# EAGLE design SOC_level_indicator (EAGLE 7.3.0)
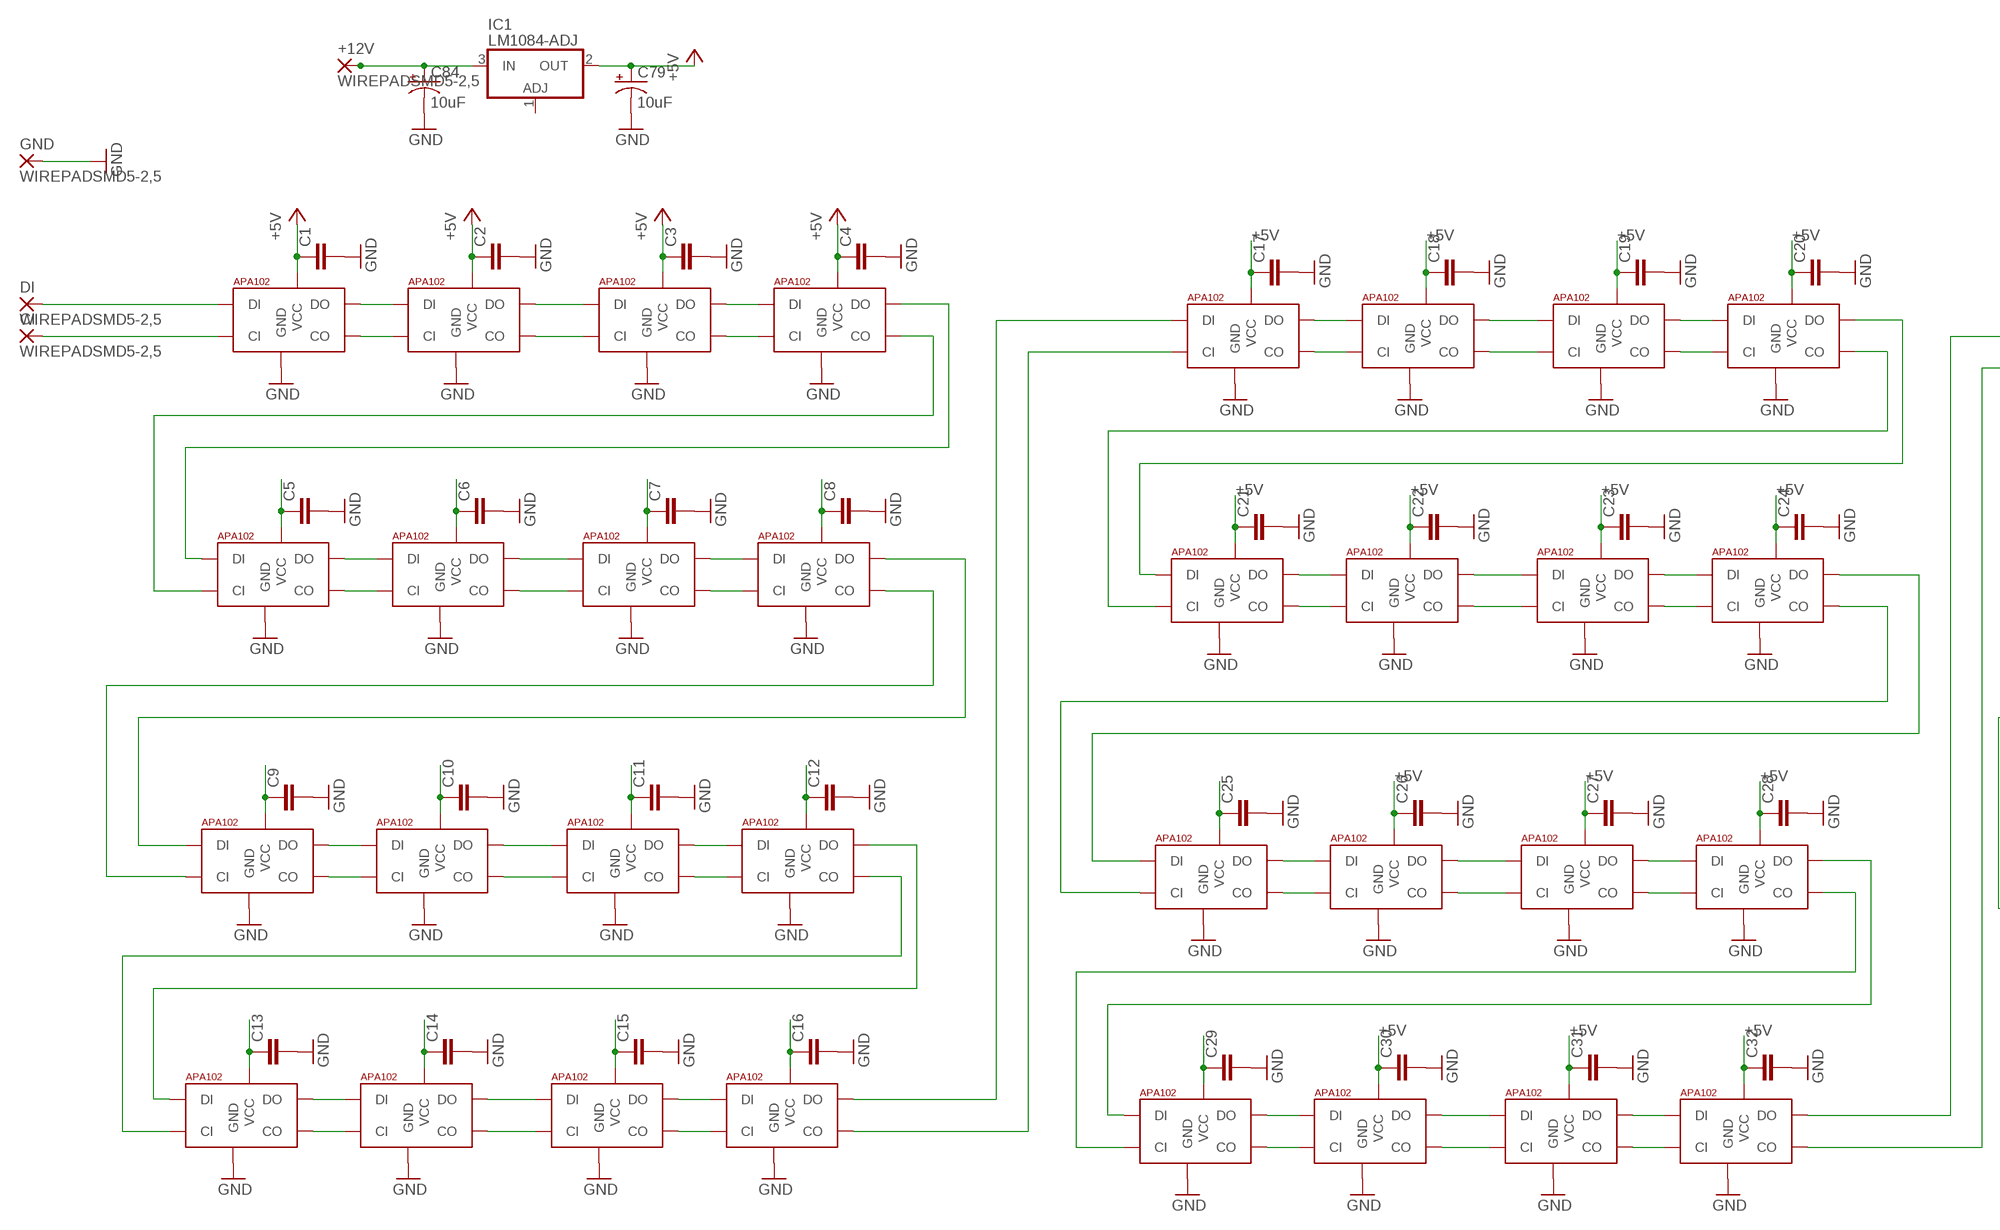
[diagram p0: schematic, sheet 1, part 1 of 2]
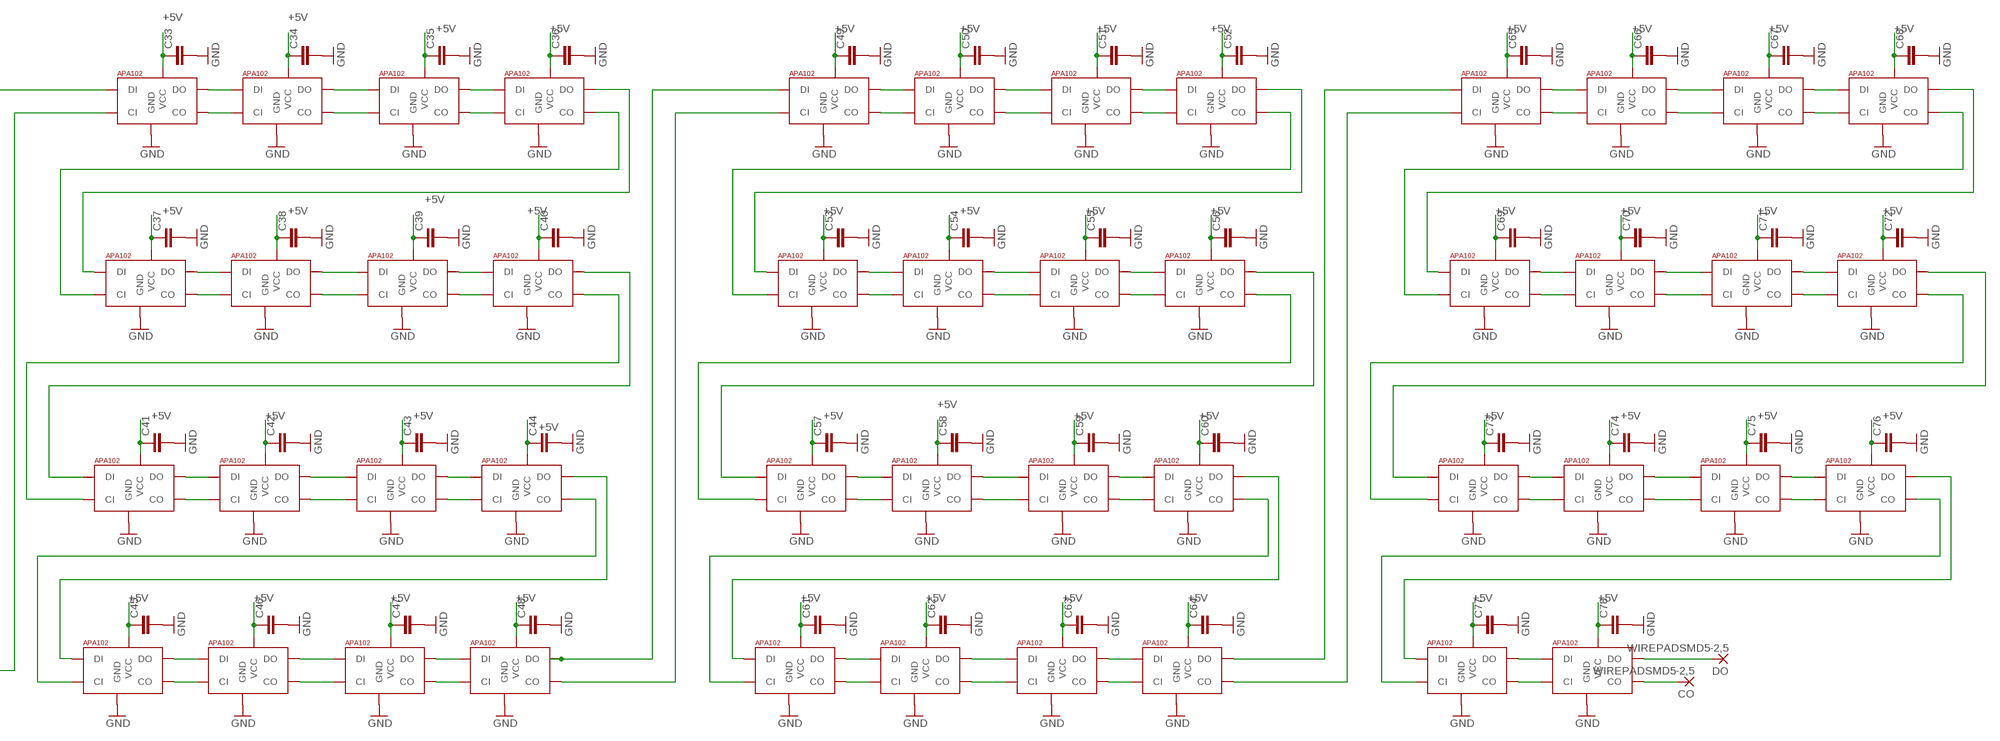
[diagram p1: schematic, sheet 1, part 2 of 2]

## Parts
+12V  WIREPADSMD5-2,5  [5-2,5]
C1  CAP0603-CAP  [0603-CAP]
C2  CAP0603-CAP  [0603-CAP]
C3  CAP0603-CAP  [0603-CAP]
C4  CAP0603-CAP  [0603-CAP]
C5  CAP0603-CAP  [0603-CAP]
C6  CAP0603-CAP  [0603-CAP]
C7  CAP0603-CAP  [0603-CAP]
C8  CAP0603-CAP  [0603-CAP]
C9  CAP0603-CAP  [0603-CAP]
C10  CAP0603-CAP  [0603-CAP]
C11  CAP0603-CAP  [0603-CAP]
C12  CAP0603-CAP  [0603-CAP]
C13  CAP0603-CAP  [0603-CAP]
C14  CAP0603-CAP  [0603-CAP]
C15  CAP0603-CAP  [0603-CAP]
C16  CAP0603-CAP  [0603-CAP]
C17  CAP0603-CAP  [0603-CAP]
C18  CAP0603-CAP  [0603-CAP]
C19  CAP0603-CAP  [0603-CAP]
C20  CAP0603-CAP  [0603-CAP]
C21  CAP0603-CAP  [0603-CAP]
C22  CAP0603-CAP  [0603-CAP]
C23  CAP0603-CAP  [0603-CAP]
C24  CAP0603-CAP  [0603-CAP]
C25  CAP0603-CAP  [0603-CAP]
C26  CAP0603-CAP  [0603-CAP]
C27  CAP0603-CAP  [0603-CAP]
C28  CAP0603-CAP  [0603-CAP]
C29  CAP0603-CAP  [0603-CAP]
C30  CAP0603-CAP  [0603-CAP]
C31  CAP0603-CAP  [0603-CAP]
C32  CAP0603-CAP  [0603-CAP]
C33  CAP0603-CAP  [0603-CAP]
C34  CAP0603-CAP  [0603-CAP]
C35  CAP0603-CAP  [0603-CAP]
C36  CAP0603-CAP  [0603-CAP]
C37  CAP0603-CAP  [0603-CAP]
C38  CAP0603-CAP  [0603-CAP]
C39  CAP0603-CAP  [0603-CAP]
C40  CAP0603-CAP  [0603-CAP]
C41  CAP0603-CAP  [0603-CAP]
C42  CAP0603-CAP  [0603-CAP]
C43  CAP0603-CAP  [0603-CAP]
C44  CAP0603-CAP  [0603-CAP]
C45  CAP0603-CAP  [0603-CAP]
C46  CAP0603-CAP  [0603-CAP]
C47  CAP0603-CAP  [0603-CAP]
C48  CAP0603-CAP  [0603-CAP]
C49  CAP0603-CAP  [0603-CAP]
C50  CAP0603-CAP  [0603-CAP]
C51  CAP0603-CAP  [0603-CAP]
C52  CAP0603-CAP  [0603-CAP]
C53  CAP0603-CAP  [0603-CAP]
C54  CAP0603-CAP  [0603-CAP]
C55  CAP0603-CAP  [0603-CAP]
C56  CAP0603-CAP  [0603-CAP]
C57  CAP0603-CAP  [0603-CAP]
C58  CAP0603-CAP  [0603-CAP]
C59  CAP0603-CAP  [0603-CAP]
C60  CAP0603-CAP  [0603-CAP]
C61  CAP0603-CAP  [0603-CAP]
C62  CAP0603-CAP  [0603-CAP]
C63  CAP0603-CAP  [0603-CAP]
C64  CAP0603-CAP  [0603-CAP]
C65  CAP0603-CAP  [0603-CAP]
C66  CAP0603-CAP  [0603-CAP]
C67  CAP0603-CAP  [0603-CAP]
C68  CAP0603-CAP  [0603-CAP]
C69  CAP0603-CAP  [0603-CAP]
C70  CAP0603-CAP  [0603-CAP]
C71  CAP0603-CAP  [0603-CAP]
C72  CAP0603-CAP  [0603-CAP]
C73  CAP0603-CAP  [0603-CAP]
C74  CAP0603-CAP  [0603-CAP]
C75  CAP0603-CAP  [0603-CAP]
C76  CAP0603-CAP  [0603-CAP]
C77  CAP0603-CAP  [0603-CAP]
C78  CAP0603-CAP  [0603-CAP]
C79  10uF  10UF-16V-10%(TANT)  [EIA3216]
C84  10uF  10UF-16V-10%(TANT)  [EIA3216]
CI  WIREPADSMD5-2,5  [5-2,5]
CO  WIREPADSMD5-2,5  [5-2,5]
DI  WIREPADSMD5-2,5  [5-2,5]
DO  WIREPADSMD5-2,5  [5-2,5]
GND  WIREPADSMD5-2,5  [5-2,5]
IC1  LM1084-ADJ  [TO263-3]
U$1  APA1025050  [APA102_5050]
U$2  APA1025050  [APA102_5050]
U$3  APA1025050  [APA102_5050]
U$4  APA1025050  [APA102_5050]
U$5  APA1025050  [APA102_5050]
U$6  APA1025050  [APA102_5050]
U$7  APA1025050  [APA102_5050]
U$8  APA1025050  [APA102_5050]
U$9  APA1025050  [APA102_5050]
U$10  APA1025050  [APA102_5050]
U$11  APA1025050  [APA102_5050]
U$12  APA1025050  [APA102_5050]
U$13  APA1025050  [APA102_5050]
U$14  APA1025050  [APA102_5050]
U$15  APA1025050  [APA102_5050]
U$16  APA1025050  [APA102_5050]
U$17  APA1025050  [APA102_5050]
U$18  APA1025050  [APA102_5050]
U$19  APA1025050  [APA102_5050]
U$20  APA1025050  [APA102_5050]
U$21  APA1025050  [APA102_5050]
U$22  APA1025050  [APA102_5050]
U$23  APA1025050  [APA102_5050]
U$24  APA1025050  [APA102_5050]
U$25  APA1025050  [APA102_5050]
U$26  APA1025050  [APA102_5050]
U$27  APA1025050  [APA102_5050]
U$28  APA1025050  [APA102_5050]
U$29  APA1025050  [APA102_5050]
U$30  APA1025050  [APA102_5050]
U$31  APA1025050  [APA102_5050]
U$32  APA1025050  [APA102_5050]
U$33  APA1025050  [APA102_5050]
U$34  APA1025050  [APA102_5050]
U$35  APA1025050  [APA102_5050]
U$36  APA1025050  [APA102_5050]
U$37  APA1025050  [APA102_5050]
U$38  APA1025050  [APA102_5050]
U$39  APA1025050  [APA102_5050]
U$40  APA1025050  [APA102_5050]
U$41  APA1025050  [APA102_5050]
U$42  APA1025050  [APA102_5050]
U$43  APA1025050  [APA102_5050]
U$44  APA1025050  [APA102_5050]
U$45  APA1025050  [APA102_5050]
U$46  APA1025050  [APA102_5050]
U$47  APA1025050  [APA102_5050]
U$48  APA1025050  [APA102_5050]
U$49  APA1025050  [APA102_5050]
U$50  APA1025050  [APA102_5050]
U$51  APA1025050  [APA102_5050]
U$52  APA1025050  [APA102_5050]
U$53  APA1025050  [APA102_5050]
U$54  APA1025050  [APA102_5050]
U$55  APA1025050  [APA102_5050]
U$56  APA1025050  [APA102_5050]
U$57  APA1025050  [APA102_5050]
U$58  APA1025050  [APA102_5050]
U$59  APA1025050  [APA102_5050]
U$60  APA1025050  [APA102_5050]
U$61  APA1025050  [APA102_5050]
U$62  APA1025050  [APA102_5050]
U$63  APA1025050  [APA102_5050]
U$64  APA1025050  [APA102_5050]
U$65  APA1025050  [APA102_5050]
U$66  APA1025050  [APA102_5050]
U$67  APA1025050  [APA102_5050]
U$68  APA1025050  [APA102_5050]
U$69  APA1025050  [APA102_5050]
U$70  APA1025050  [APA102_5050]
U$71  APA1025050  [APA102_5050]
U$72  APA1025050  [APA102_5050]
U$73  APA1025050  [APA102_5050]
U$74  APA1025050  [APA102_5050]
U$75  APA1025050  [APA102_5050]
U$76  APA1025050  [APA102_5050]
U$77  APA1025050  [APA102_5050]
U$78  APA1025050  [APA102_5050]

## Nets
+5V: C1.1 C2.1 C3.1 C4.1 C5.1 C6.1 C7.1 C8.1 C9.1 C10.1 C11.1 C12.1 C13.1 C14.1 C15.1 C16.1 C17.1 C18.1 C19.1 C20.1 C21.1 C22.1 C23.1 C24.1 C25.1 C26.1 C27.1 C28.1 C29.1 C30.1 C31.1 C32.1 C33.1 C34.1 C35.1 C36.1 C37.1 C38.1 C39.1 C40.1 C41.1 C42.1 C43.1 C44.1 C45.1 C46.1 C47.1 C48.1 C49.1 C50.1 C51.1 C52.1 C53.1 C54.1 C55.1 C56.1 C57.1 C58.1 C59.1 C60.1 C61.1 C62.1 C63.1 C64.1 C65.1 C66.1 C67.1 C68.1 C69.1 C70.1 C71.1 C72.1 C73.1 C74.1 C75.1 C76.1 C77.1 C78.1 C79.A(+) IC1.2(OUT) U$1.1(VCC) U$2.1(VCC) U$3.1(VCC) U$4.1(VCC) U$5.1(VCC) U$6.1(VCC) U$7.1(VCC) U$8.1(VCC) U$9.1(VCC) U$10.1(VCC) U$11.1(VCC) U$12.1(VCC) U$13.1(VCC) U$14.1(VCC) U$15.1(VCC) U$16.1(VCC) U$17.1(VCC) U$18.1(VCC) U$19.1(VCC) U$20.1(VCC) U$21.1(VCC) U$22.1(VCC) U$23.1(VCC) U$24.1(VCC) U$25.1(VCC) U$26.1(VCC) U$27.1(VCC) U$28.1(VCC) U$29.1(VCC) U$30.1(VCC) U$31.1(VCC) U$32.1(VCC) U$33.1(VCC) U$34.1(VCC) U$35.1(VCC) U$36.1(VCC) U$37.1(VCC) U$38.1(VCC) U$39.1(VCC) U$40.1(VCC) U$41.1(VCC) U$42.1(VCC) U$43.1(VCC) U$44.1(VCC) U$45.1(VCC) U$46.1(VCC) U$47.1(VCC) U$48.1(VCC) U$49.1(VCC) U$50.1(VCC) U$51.1(VCC) U$52.1(VCC) U$53.1(VCC) U$54.1(VCC) U$55.1(VCC) U$56.1(VCC) U$57.1(VCC) U$58.1(VCC) U$59.1(VCC) U$60.1(VCC) U$61.1(VCC) U$62.1(VCC) U$63.1(VCC) U$64.1(VCC) U$65.1(VCC) U$66.1(VCC) U$67.1(VCC) U$68.1(VCC) U$69.1(VCC) U$70.1(VCC) U$71.1(VCC) U$72.1(VCC) U$73.1(VCC) U$74.1(VCC) U$75.1(VCC) U$76.1(VCC) U$77.1(VCC) U$78.1(VCC)
+12V: +12V.1(P) C84.A(+) IC1.3(IN)
GND: C1.2 C2.2 C3.2 C4.2 C5.2 C6.2 C7.2 C8.2 C9.2 C10.2 C11.2 C12.2 C13.2 C14.2 C15.2 C16.2 C17.2 C18.2 C19.2 C20.2 C21.2 C22.2 C23.2 C24.2 C25.2 C26.2 C27.2 C28.2 C29.2 C30.2 C31.2 C32.2 C33.2 C34.2 C35.2 C36.2 C37.2 C38.2 C39.2 C40.2 C41.2 C42.2 C43.2 C44.2 C45.2 C46.2 C47.2 C48.2 C49.2 C50.2 C51.2 C52.2 C53.2 C54.2 C55.2 C56.2 C57.2 C58.2 C59.2 C60.2 C61.2 C62.2 C63.2 C64.2 C65.2 C66.2 C67.2 C68.2 C69.2 C70.2 C71.2 C72.2 C73.2 C74.2 C75.2 C76.2 C77.2 C78.2 C79.C(-) C84.C(-) GND.1(P) U$1.6(GND) U$2.6(GND) U$3.6(GND) U$4.6(GND) U$5.6(GND) U$6.6(GND) U$7.6(GND) U$8.6(GND) U$9.6(GND) U$10.6(GND) U$11.6(GND) U$12.6(GND) U$13.6(GND) U$14.6(GND) U$15.6(GND) U$16.6(GND) U$17.6(GND) U$18.6(GND) U$19.6(GND) U$20.6(GND) U$21.6(GND) U$22.6(GND) U$23.6(GND) U$24.6(GND) U$25.6(GND) U$26.6(GND) U$27.6(GND) U$28.6(GND) U$29.6(GND) U$30.6(GND) U$31.6(GND) U$32.6(GND) U$33.6(GND) U$34.6(GND) U$35.6(GND) U$36.6(GND) U$37.6(GND) U$38.6(GND) U$39.6(GND) U$40.6(GND) U$41.6(GND) U$42.6(GND) U$43.6(GND) U$44.6(GND) U$45.6(GND) U$46.6(GND) U$47.6(GND) U$48.6(GND) U$49.6(GND) U$50.6(GND) U$51.6(GND) U$52.6(GND) U$53.6(GND) U$54.6(GND) U$55.6(GND) U$56.6(GND) U$57.6(GND) U$58.6(GND) U$59.6(GND) U$60.6(GND) U$61.6(GND) U$62.6(GND) U$63.6(GND) U$64.6(GND) U$65.6(GND) U$66.6(GND) U$67.6(GND) U$68.6(GND) U$69.6(GND) U$70.6(GND) U$71.6(GND) U$72.6(GND) U$73.6(GND) U$74.6(GND) U$75.6(GND) U$76.6(GND) U$77.6(GND) U$78.6(GND)
N$1: U$1.3(DO) U$2.4(DI)
N$2: U$1.2(CO) U$2.5(CI)
N$3: U$3.3(DO) U$4.4(DI)
N$4: U$3.2(CO) U$4.5(CI)
N$5: U$2.3(DO) U$3.4(DI)
N$6: U$2.2(CO) U$3.5(CI)
N$7: U$5.3(DO) U$6.4(DI)
N$8: U$5.2(CO) U$6.5(CI)
N$9: U$7.3(DO) U$8.4(DI)
N$10: U$7.2(CO) U$8.5(CI)
N$11: U$6.3(DO) U$7.4(DI)
N$12: U$6.2(CO) U$7.5(CI)
N$13: U$4.2(CO) U$5.5(CI)
N$14: U$4.3(DO) U$5.4(DI)
N$15: U$9.3(DO) U$10.4(DI)
N$16: U$9.2(CO) U$10.5(CI)
N$17: U$11.3(DO) U$12.4(DI)
N$18: U$11.2(CO) U$12.5(CI)
N$19: U$10.3(DO) U$11.4(DI)
N$20: U$10.2(CO) U$11.5(CI)
N$21: U$13.3(DO) U$14.4(DI)
N$22: U$13.2(CO) U$14.5(CI)
N$23: U$15.3(DO) U$16.4(DI)
N$24: U$15.2(CO) U$16.5(CI)
N$25: U$14.3(DO) U$15.4(DI)
N$26: U$14.2(CO) U$15.5(CI)
N$27: U$12.2(CO) U$13.5(CI)
N$28: U$12.3(DO) U$13.4(DI)
N$29: U$8.2(CO) U$9.5(CI)
N$30: U$8.3(DO) U$9.4(DI)
N$31: U$17.3(DO) U$18.4(DI)
N$32: U$17.2(CO) U$18.5(CI)
N$33: U$19.3(DO) U$20.4(DI)
N$34: U$19.2(CO) U$20.5(CI)
N$35: U$18.3(DO) U$19.4(DI)
N$36: U$18.2(CO) U$19.5(CI)
N$37: U$21.3(DO) U$22.4(DI)
N$38: U$21.2(CO) U$22.5(CI)
N$39: U$23.3(DO) U$24.4(DI)
N$40: U$23.2(CO) U$24.5(CI)
N$41: U$22.3(DO) U$23.4(DI)
N$42: U$22.2(CO) U$23.5(CI)
N$43: U$20.2(CO) U$21.5(CI)
N$44: U$20.3(DO) U$21.4(DI)
N$45: U$25.3(DO) U$26.4(DI)
N$46: U$25.2(CO) U$26.5(CI)
N$47: U$27.3(DO) U$28.4(DI)
N$48: U$27.2(CO) U$28.5(CI)
N$49: U$26.3(DO) U$27.4(DI)
N$50: U$26.2(CO) U$27.5(CI)
N$51: U$29.3(DO) U$30.4(DI)
N$52: U$29.2(CO) U$30.5(CI)
N$53: U$31.3(DO) U$32.4(DI)
N$54: U$31.2(CO) U$32.5(CI)
N$55: U$30.3(DO) U$31.4(DI)
N$56: U$30.2(CO) U$31.5(CI)
N$57: U$28.2(CO) U$29.5(CI)
N$58: U$28.3(DO) U$29.4(DI)
N$59: U$24.2(CO) U$25.5(CI)
N$60: U$24.3(DO) U$25.4(DI)
N$61: U$16.3(DO) U$17.4(DI)
N$62: U$16.2(CO) U$17.5(CI)
N$63: U$33.3(DO) U$34.4(DI)
N$64: U$33.2(CO) U$34.5(CI)
N$65: U$35.3(DO) U$36.4(DI)
N$66: U$35.2(CO) U$36.5(CI)
N$67: U$34.3(DO) U$35.4(DI)
N$68: U$34.2(CO) U$35.5(CI)
N$69: U$37.3(DO) U$38.4(DI)
N$70: U$37.2(CO) U$38.5(CI)
N$71: U$39.3(DO) U$40.4(DI)
N$72: U$39.2(CO) U$40.5(CI)
N$73: U$38.3(DO) U$39.4(DI)
N$74: U$38.2(CO) U$39.5(CI)
N$75: U$36.2(CO) U$37.5(CI)
N$76: U$36.3(DO) U$37.4(DI)
N$77: U$41.3(DO) U$42.4(DI)
N$78: U$41.2(CO) U$42.5(CI)
N$79: U$43.3(DO) U$44.4(DI)
N$80: U$43.2(CO) U$44.5(CI)
N$81: U$42.3(DO) U$43.4(DI)
N$82: U$42.2(CO) U$43.5(CI)
N$83: U$45.3(DO) U$46.4(DI)
N$84: U$45.2(CO) U$46.5(CI)
N$85: U$47.3(DO) U$48.4(DI)
N$86: U$47.2(CO) U$48.5(CI)
N$87: U$46.3(DO) U$47.4(DI)
N$88: U$46.2(CO) U$47.5(CI)
N$89: U$44.2(CO) U$45.5(CI)
N$90: U$44.3(DO) U$45.4(DI)
N$91: U$40.2(CO) U$41.5(CI)
N$92: U$40.3(DO) U$41.4(DI)
N$93: U$32.3(DO) U$33.4(DI)
N$94: U$32.2(CO) U$33.5(CI)
N$95: U$49.3(DO) U$50.4(DI)
N$96: U$49.2(CO) U$50.5(CI)
N$97: U$51.3(DO) U$52.4(DI)
N$98: U$51.2(CO) U$52.5(CI)
N$99: U$50.3(DO) U$51.4(DI)
N$100: U$50.2(CO) U$51.5(CI)
N$101: U$53.3(DO) U$54.4(DI)
N$102: U$53.2(CO) U$54.5(CI)
N$103: U$55.3(DO) U$56.4(DI)
N$104: U$55.2(CO) U$56.5(CI)
N$105: U$54.3(DO) U$55.4(DI)
N$106: U$54.2(CO) U$55.5(CI)
N$107: U$52.2(CO) U$53.5(CI)
N$108: U$52.3(DO) U$53.4(DI)
N$109: U$57.3(DO) U$58.4(DI)
N$110: U$57.2(CO) U$58.5(CI)
N$111: U$59.3(DO) U$60.4(DI)
N$112: U$59.2(CO) U$60.5(CI)
N$113: U$58.3(DO) U$59.4(DI)
N$114: U$58.2(CO) U$59.5(CI)
N$115: U$61.3(DO) U$62.4(DI)
N$116: U$61.2(CO) U$62.5(CI)
N$117: U$63.3(DO) U$64.4(DI)
N$118: U$63.2(CO) U$64.5(CI)
N$119: U$62.3(DO) U$63.4(DI)
N$120: U$62.2(CO) U$63.5(CI)
N$121: U$60.2(CO) U$61.5(CI)
N$122: U$60.3(DO) U$61.4(DI)
N$123: U$56.2(CO) U$57.5(CI)
N$124: U$56.3(DO) U$57.4(DI)
N$125: U$48.3(DO) U$49.4(DI)
N$126: U$48.2(CO) U$49.5(CI)
N$127: U$65.3(DO) U$66.4(DI)
N$128: U$65.2(CO) U$66.5(CI)
N$129: U$67.3(DO) U$68.4(DI)
N$130: U$67.2(CO) U$68.5(CI)
N$131: U$66.3(DO) U$67.4(DI)
N$132: U$66.2(CO) U$67.5(CI)
N$133: U$69.3(DO) U$70.4(DI)
N$134: U$69.2(CO) U$70.5(CI)
N$135: U$71.3(DO) U$72.4(DI)
N$136: U$71.2(CO) U$72.5(CI)
N$137: U$70.3(DO) U$71.4(DI)
N$138: U$70.2(CO) U$71.5(CI)
N$139: U$68.2(CO) U$69.5(CI)
N$140: U$68.3(DO) U$69.4(DI)
N$141: U$73.3(DO) U$74.4(DI)
N$142: U$73.2(CO) U$74.5(CI)
N$143: U$75.3(DO) U$76.4(DI)
N$144: U$75.2(CO) U$76.5(CI)
N$145: U$74.3(DO) U$75.4(DI)
N$146: U$74.2(CO) U$75.5(CI)
N$147: U$77.3(DO) U$78.4(DI)
N$148: U$77.2(CO) U$78.5(CI)
N$149: DI.1(P) U$1.4(DI)
N$150: CI.1(P) U$1.5(CI)
N$151: DO.1(P) U$78.3(DO)
N$152: CO.1(P) U$78.2(CO)
N$153: U$76.2(CO) U$77.5(CI)
N$154: U$76.3(DO) U$77.4(DI)
N$155: U$72.2(CO) U$73.5(CI)
N$156: U$72.3(DO) U$73.4(DI)
N$157: U$64.3(DO) U$65.4(DI)
N$158: U$64.2(CO) U$65.5(CI)
Unconnected: IC1.1(ADJ)

## Library data of the parts
+12V CI CO DI DO GND = wirepad:WIREPAD: Wire PAD connect wire on PCB
C1-C78 = SparkFun-Capacitors:CAP: Capacitor Standard 0603 ceramic capacitor, and 0.1" leaded capacitor.
C79 C84 = SparkFun-Capacitors:10UF-16V-10%(TANT): CAP-00811 1206/EIA-3216 Tantalum capacitor; PROD_ID: CAP-00811
IC1 = lm1084-adj-to263:LM1084-ADJ: LM1084-ADJ 5A 29V - Voltage Regulator Autor: Cleber Moretti Web site: http://www.binarycodec.blogspot.com v.1.2
U$1-U$78 = jos-ph:APA102: APA102C 5050 RGB LED -- Adafruit DotStar Single LED Pixel Product Page: https://www.adafruit.com/products/2343 Datasheet: https://cdn-shop.adafruit.com/product-files/2343/APA102C.pdf

## Board
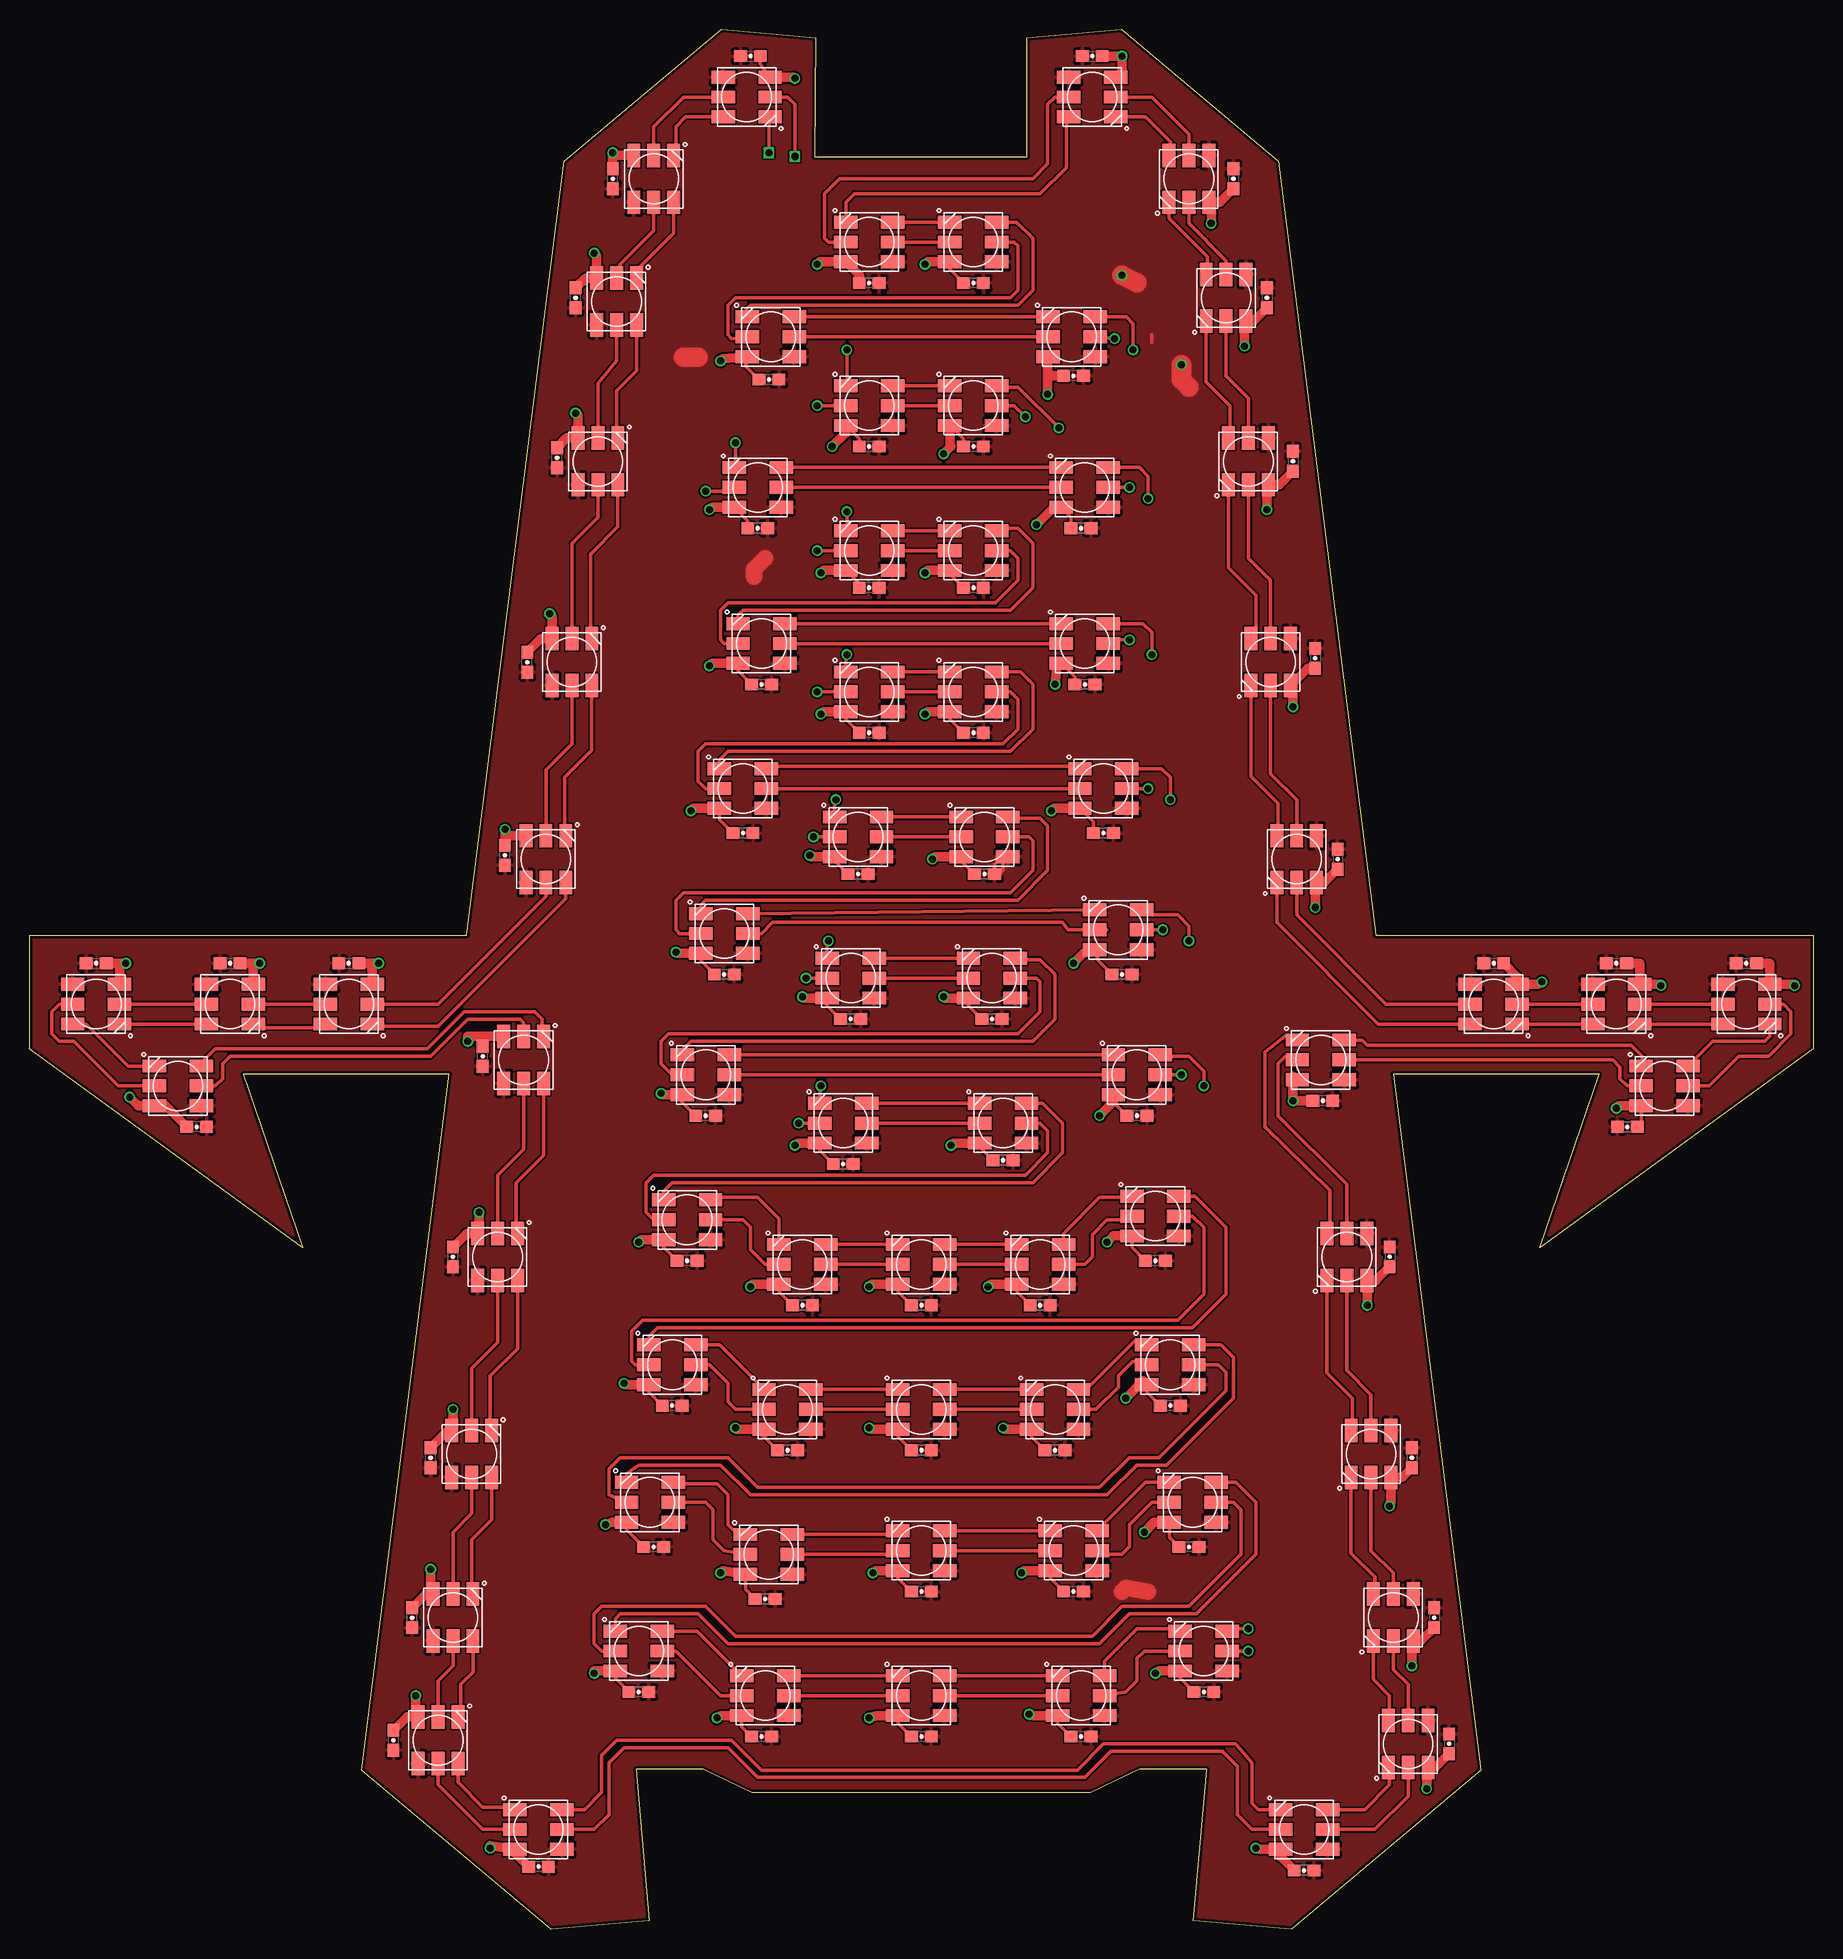
[diagram p2: board, top side]
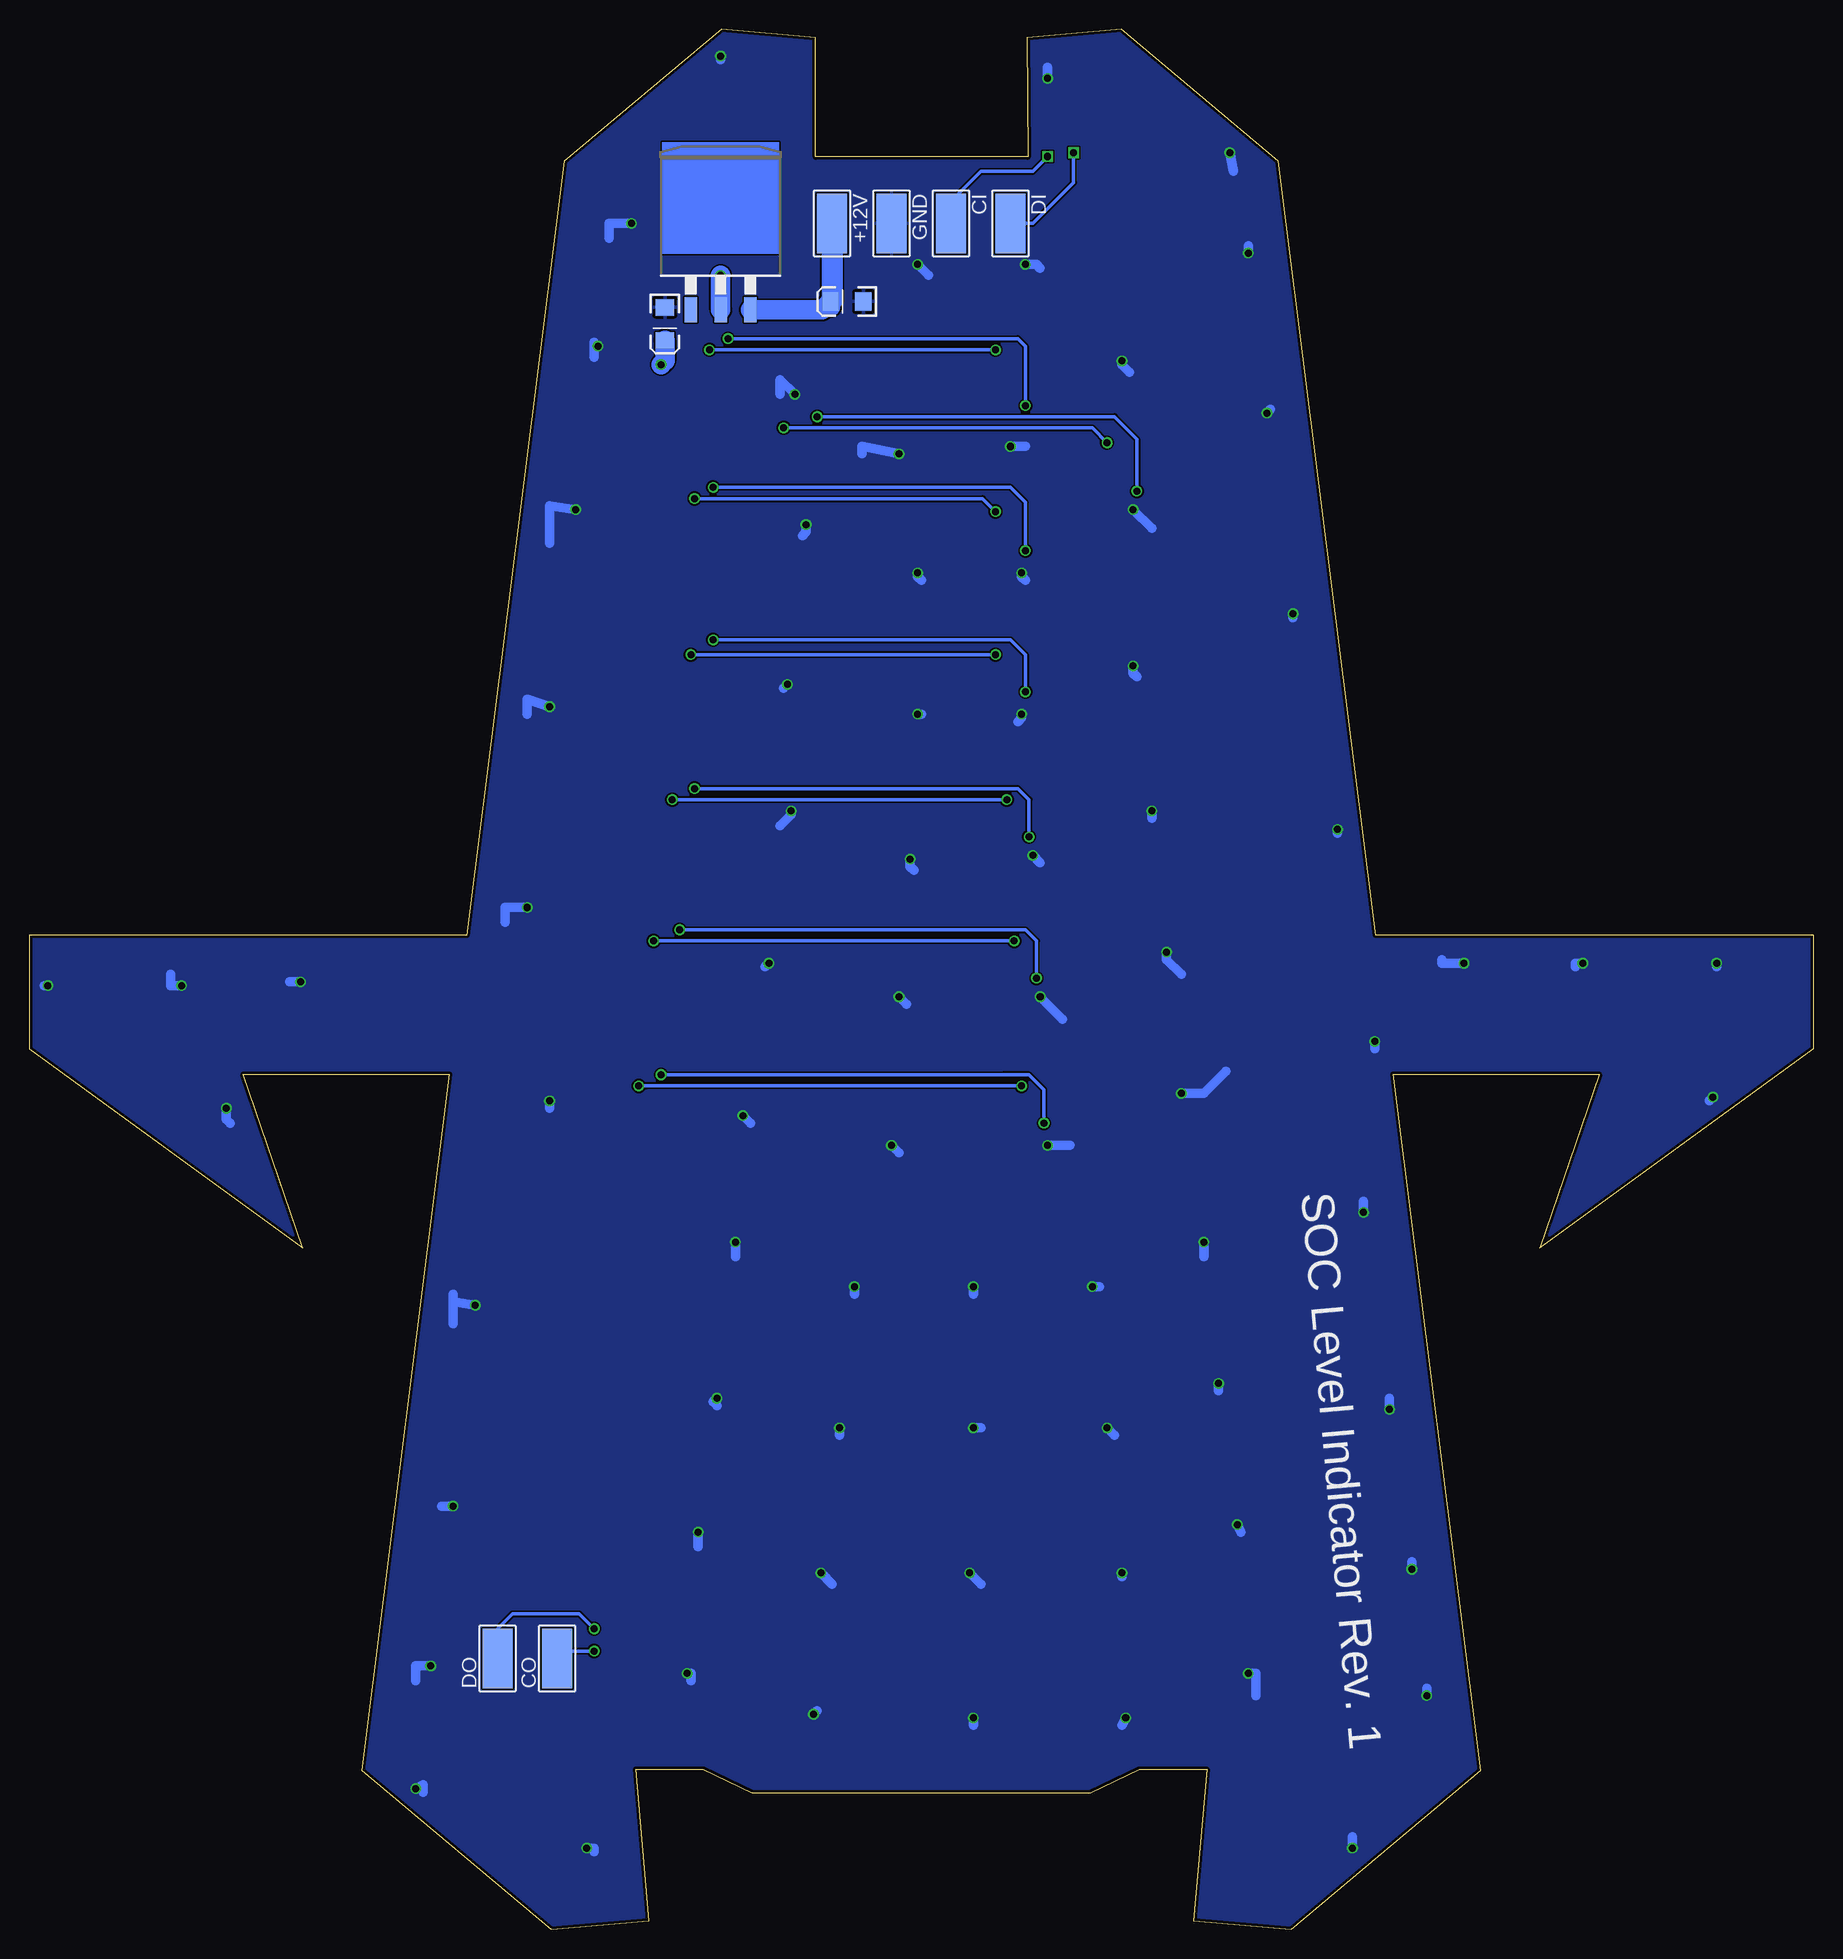
[diagram p3: board, bottom side, seen from below]

Size 152.4 x 162.28 mm. Coordinates in mm from the lower left corner, seen from the top.
Outline: 115.02,84.91 152.4,84.91 152.4,75.21 129.03,58.23 134.12,73.03 116.51,73.03 123.99,13.58 107.81,0 99.45,0.73 100.58,13.68 94.83,13.68 90.67,11.68 61.73,11.68 57.57,13.68 51.82,13.68 52.95,0.73 44.59,0 28.41,13.58 35.89,73.03 18.28,73.03 23.37,58.23 0,75.21 0,84.91 37.38,84.91 45.7,151.01 59.12,162.28 67.17,161.57 67.1,151.38 85.23,151.38 85.23,161.57 93.28,162.28 106.7,151.01 115.02,84.91
Copper layers (1*16): Top 0.035mm / dielectric 1.5mm / Bottom 0.035mm
Design rules "SeeedStudio_2layer_DRU_no_angle_20140221": minimum track width 6mil, minimum drill 12mil, track to track 6mil, track to pad 6mil, pad to pad 6mil, via to via 6mil, smd to smd 0mil, copper to edge 10mil, drill to drill 10mil, minimum pad ring 10mil, minimum via ring 6mil, stop-mask expansion 2mil, vias tented up to drill 100mil, thermal gap 10mil

### Footprints (pad centres in the part's own frame; a part is rotated, then mirrored left to right if it is on the bottom)
5-2,5 = smd 2.54 x 5.08: 1 0,0
0603-CAP = smd 1.1 x 1: 1 -0.85,0; 2 0.85,0
EIA3216 = smd 1.4 x 1.6: A 1.4,0; C -1.4,0
TO263-3 = smd 1.067 x 2.159: 1 -2.54,-5.791; 2 0,-5.791; 3 2.54,-5.791
APA102_5050 = smd 2 x 1.1: 1 2,-1.7; 2 2,0; 3 2,1.7; 4 -2,1.7; 5 -2,0; 6 -2,-1.7

### Placement (x,y rotation side)
+12V  83.82,145.7 180 bottom
C1  61.59,159.98 0 top
C2  49.85,149.51 90 top
C3  46.67,139.35 90 top
C4  45.09,125.69 90 top
C5  42.55,108.23 90 top
C6  40.64,91.72 90 top
C7  27.3,82.51 0 top
C8  17.14,82.51 0 top
C9  5.71,82.51 0 top
C10  14.29,68.54 180 top
C11  38.73,74.58 90 top
C12  36.2,57.43 90 top
C13  34.29,40.29 90 top
C14  32.7,26.63 90 top
C15  31.11,16.16 90 top
C16  43.5,5.36 180 top
C17  108.9,5.04 180 top
C18  121.28,15.84 270 top
C19  120.02,26.63 270 top
C20  118.11,40.29 270 top
C21  116.2,57.43 270 top
C22  110.49,70.77 180 top
C23  136.53,68.54 0 top
C24  146.69,82.51 0 top
C25  135.57,82.51 0 top
C26  125.09,82.51 0 top
C27  111.76,91.4 270 top
C28  109.86,108.55 270 top
C29  107.95,125.38 270 top
C30  105.73,139.35 270 top
C31  102.87,149.51 270 top
C32  90.81,159.98 0 top
C33  71.75,140.62 180 top
C34  80.64,140.62 180 top
C35  63.18,132.36 180 top
C36  89.22,132.68 180 top
C37  71.75,126.65 180 top
C38  80.64,126.65 180 top
C39  62.23,119.66 180 top
C40  89.85,119.66 180 top
C41  71.75,114.58 180 top
C42  80.64,114.58 180 top
C43  62.55,106.33 180 top
C44  90.17,106.33 180 top
C45  71.75,102.2 180 top
C46  80.64,102.2 180 top
C47  60.96,93.63 180 top
C48  91.76,93.63 180 top
C49  70.8,90.13 180 top
C50  81.6,90.13 180 top
C51  59.37,81.56 180 top
C52  93.34,81.56 180 top
C53  70.17,77.75 180 top
C54  82.23,77.75 180 top
C55  57.79,69.5 180 top
C56  94.62,69.5 180 top
C57  69.53,65.37 180 top
C58  83.19,65.69 180 top
C59  56.2,57.11 180 top
C60  66.04,53.3 180 top
C61  76.2,53.3 180 top
C62  86.36,53.3 180 top
C63  96.2,57.11 180 top
C64  54.93,44.73 180 top
C65  64.77,40.92 180 top
C66  76.2,40.92 180 top
C67  87.63,40.92 180 top
C68  97.47,44.73 180 top
C69  53.34,32.67 180 top
C70  62.87,28.22 180 top
C71  76.2,28.86 180 top
C72  89.22,28.86 180 top
C73  99.06,32.67 180 top
C74  52.07,20.28 180 top
C75  62.55,16.47 180 top
C76  76.2,16.47 180 top
C77  89.85,16.47 180 top
C78  100.33,20.28 180 top
C79  98.11,137.12 270 bottom
C84  82.55,139.03 180 bottom
CI  73.66,145.7 180 bottom
CO  107.31,23.14 0 bottom
DI  68.58,145.7 180 bottom
DO  112.39,23.14 0 bottom
GND  78.74,145.7 180 bottom
IC1  93.34,144.11 0 bottom
U$1  61.28,156.49 180 top
U$2  53.34,149.51 270 top
U$3  50.16,139.03 270 top
U$4  48.58,125.38 270 top
U$5  46.36,108.23 270 top
U$6  44.13,91.4 270 top
U$7  27.3,79.02 180 top
U$8  17.14,79.02 180 top
U$9  5.71,79.02 180 top
U$10  12.7,72.04 0 top
U$11  42.23,74.26 270 top
U$12  40.01,57.43 270 top
U$13  37.78,40.6 270 top
U$14  36.2,26.63 270 top
U$15  34.92,16.16 270 top
U$16  43.5,8.54 0 top
U$17  108.9,8.54 0 top
U$18  117.79,15.84 90 top
U$19  116.52,26.63 90 top
U$20  114.62,40.6 90 top
U$21  112.55,57.43 90 top
U$22  110.33,74.26 0 top
U$23  139.7,72.04 0 top
U$24  146.69,79.02 180 top
U$25  135.57,79.02 180 top
U$26  125.09,79.02 180 top
U$27  108.27,91.4 90 top
U$28  106.05,108.23 90 top
U$29  104.14,125.38 90 top
U$30  102.23,139.35 90 top
U$31  99.06,149.51 90 top
U$32  90.81,156.49 180 top
U$33  71.75,144.11 0 top
U$34  80.64,144.11 0 top
U$35  63.34,136.01 0 top
U$36  89.06,136.01 0 top
U$37  71.75,130.14 0 top
U$38  80.64,130.14 0 top
U$39  62.23,123.15 0 top
U$40  90.17,123.15 0 top
U$41  71.75,117.76 0 top
U$42  80.64,117.76 0 top
U$43  62.55,109.82 0 top
U$44  90.17,109.82 0 top
U$45  71.75,105.69 0 top
U$46  80.64,105.69 0 top
U$47  60.96,97.44 0 top
U$48  91.76,97.44 0 top
U$49  70.8,93.31 0 top
U$50  81.6,93.31 0 top
U$51  59.37,85.05 0 top
U$52  93.03,85.37 0 top
U$53  70.17,81.24 0 top
U$54  82.23,81.24 0 top
U$55  57.79,72.99 0 top
U$56  94.62,72.99 0 top
U$57  69.53,68.86 0 top
U$58  83.19,68.86 0 top
U$59  56.2,60.61 0 top
U$60  66.04,56.8 0 top
U$61  76.2,56.8 0 top
U$62  86.36,56.8 0 top
U$63  96.2,60.92 0 top
U$64  54.93,48.22 0 top
U$65  64.77,44.41 0 top
U$66  76.2,44.41 0 top
U$67  87.63,44.41 0 top
U$68  97.47,48.22 0 top
U$69  53.02,36.48 0 top
U$70  63.18,32.03 0 top
U$71  76.2,32.35 0 top
U$72  89.22,32.35 0 top
U$73  99.38,36.48 0 top
U$74  52.07,23.78 0 top
U$75  62.87,19.97 0 top
U$76  76.2,19.97 0 top
U$77  89.85,19.97 0 top
U$78  100.33,23.78 0 top

### Tracks (layer width: path | path; a pad name or v marks a point on that pad's centre or on a via)
+5V  (via drill 0.6)
  Top 0.305: C50.1 82.45,90.98 83.19,91.72 83.19,90.45 82.55,89.82 | C44.1 91.12,106.01 91.44,106.33 | 95.89,136.17 95.89,135.54
  Top 1.422: 61.91,115.53 61.91,116.17 62.87,117.12 | 95.57,28.86 93.66,29.17 93.34,28.86
  Top 1.676: 57.15,134.27 55.88,134.27 | v93.34,141.25 94.62,140.62 | v98.42,133.63 98.42,132.36 99.06,131.73
  Bottom 1.676: IC1.2 v93.34,141.25 | C79.A 98.11,133.95 v98.42,133.63
  pour Top: 37.47,-0.35 47.62,-3.53 117.48,-2.89 133.35,21.24 127.64,49.18 171.45,87.28 119.38,89.82 109.86,164.11 43.18,166.02 32.38,90.45 -20.32,88.55 19.68,53.62 24.13,14.89 37.47,0.28
+12V
  Bottom 1.676: 83.95,138.58 C84.A 84.66,138.32 IC1.3
  Bottom 1.778: +12V.1 83.82,139.16 C84.A
GND  (via drill 0.6)
  Top 0.305: U$47.6 58.96,94.78 C47.2 | C48.2 90.91,94.59 U$48.6 | U$50.6 79.6,91.28 C50.2 | U$49.6 68.8,91.28 C49.2 | C41.2 70.91,114.91 U$41.6 | C39.2 61.38,120.3 U$39.6 | U$35.6 61.18,133.51 C35.2 | U$42.6 78.64,115.73 C42.2 | U$45.6 69.75,103.35 C45.2 | U$46.6 78.64,103.35 C46.2 | U$64.6 52.93,45.88 C64.2 | U$59.6 54.2,58.26 C59.2 | U$60.6 64.04,54.45 C60.2 | U$61.6 74.2,54.45 C61.2 | U$57.6 67.53,66.52 C57.2 | U$58.6 81.19,66.84 C58.2 | U$63.6 94.2,58.26 C63.2 | U$62.6 84.36,54.45 C62.2 | U$68.6 95.47,45.88 C68.2 | U$67.6 85.63,42.07 C67.2 | U$66.6 74.2,42.07 C66.2 | 62.77,42.39 62.77,42.07 C65.2 | U$73.6 97.38,33.5 C73.2 | U$77.6 87.85,17.62 C77.2 | U$78.6 98.33,21.43 C78.2 | U$76.6 74.2,17.62 C76.2 | U$75.6 60.87,17.31 C75.2 | U$74.6 50.07,21.43 C74.2 | U$72.6 87.22,30.01 C72.2 | U$71.6 74.2,30.01 C71.2 | U$69.6 51.02,34.13 C69.2 | U$70.6 61.18,29.05 C70.2 | U$53.6 68.17,78.9 C53.2 | U$54.6 80.23,78.9 C54.2 | U$52.6 91.34,82.71 C52.2 | U$51.6 57.37,82.71 C51.2 | U$55.6 55.79,70.65 C55.2 | 92.62,70.67 92.62,70.65 C56.2 | U$23.6 137.7,68.87 C23.2 | U$34.6 78.64,141.77 C34.2 | C40.2 89,120.62 U$40.6 | C37.2 70.91,127.29 U$37.6 | C38.2 79.8,127.29 U$38.6 | C44.2 89.32,106.97 U$44.6 | U$43.6 60.55,107.48 C43.2 | C1.2 62.45,159.34 U$1.6
  Top 0.813: U$2.6 50.26,151.51 v49.85,151.73 C2.2 | U$21.6 115.06,55.43 | 115.06,55.43 C21.2 | 115.06,55.43 115.06,55.41 114.3,55.41 v114.3,53.3 | v116.2,36.16 116.32,36.59 U$20.6 117.28,38.6 C20.2 | v118.11,22.51 118.11,24.63 U$19.6 118.87,24.63 C19.2 | v119.38,12.03 119.38,13.84 U$18.6 120.14,13.84 C18.2 | v104.78,6.95 105.09,6.84 U$17.6 106.9,6.19 C17.2 | U$78.6 96.52,22.08 v96.2,21.87 | U$77.6 85.73,18.27 v85.41,18.38 | U$76.6 72.39,18.27 v71.75,18.06 | U$75.6 59.05,18.27 v58.74,18.06 | U$74.6 48.26,22.08 v48.26,21.87 | U$14.6 34.29,28.63 | 34.29,28.63 v34.29,30.76 | U$15.6 33.02,18.16 | 33.02,18.16 v33.02,19.97 | v39.37,6.95 39.37,7.15 U$16.6 41.5,6.51 C16.2 | v36.2,44.41 36.2,42.6 U$13.6 35.76,42.6 C13.2 | v38.42,61.24 38.42,59.43 U$12.6 37.34,59.43 C12.2 | U$11.6 38.73,76.26 | 38.73,76.26 C11.2 | 38.73,76.26 37.47,76.26 v37.47,75.85 | v150.81,80.61 150.81,80.72 U$24.6 148.69,82.51 C24.2 | v129.22,80.93 128.91,80.72 U$26.6 127.09,81.36 C26.2 | v139.38,80.61 139.38,80.72 U$25.6 137.57,82.51 C25.2 | U$22.6 107.95,72.88 v107.95,70.77 C22.2 | v109.86,87.28 109.86,89.4 U$27.6 110.61,89.4 C27.2 | v107.95,104.42 107.95,106.55 U$28.6 109.21,107.7 C28.2 | v105.73,121.25 105.73,123.38 U$29.6 106.8,123.38 C29.2 | v103.82,135.22 103.82,137.35 U$30.6 104.58,137.35 C30.2 | U$31.6 100.97,147.51 | 100.97,147.51 v100.97,145.7 | U$32.6 93.34,158.19 v93.34,159.98 C32.2 | U$36.6 87,134.15 87,133 | 87,133 v87,131.09 | 78.74,128.44 U$38.6 78.64,126.74 78.74,126.65 v78.11,126.01 | C9.2 7.71,82.51 | 7.71,82.51 U$9.6 | C8.2 19.14,82.51 | 19.14,82.51 U$8.6 | C7.2 29.3,82.51 | 29.3,82.51 U$7.6 | 7.71,82.51 v8.26,82.51 | 19.14,82.51 v19.68,82.51
  Top 0.813: 29.3,82.51 v29.84,82.51 | U$6.6 40.64,93.4 | 40.64,93.4 C6.2 | 40.64,93.4 v40.64,93.94 | C10.2 11.64,70.34 U$10.6 9.32,70.34 v8.57,71.08 | U$55.6 54.09,71.29 v53.98,71.4 | U$51.6 55.36,83.35 v55.25,83.47 | U$53.6 66.15,79.54 v66.04,79.66 | U$49.6 66.79,91.61 v66.67,91.72 | U$47.6 56.72,95.74 v56.52,95.53 | U$57.6 65.61,67.16 v65.41,66.96 | U$59.6 52.28,58.91 v52.07,58.7 | U$60.6 61.8,55.1 v61.59,54.89 | U$61.6 71.96,55.1 v71.75,54.89 | U$62.6 82.12,55.1 v81.92,54.89 | U$58.6 78.95,67.16 v78.74,66.96 | U$63.6 92.6,59.22 v92.08,58.7 | U$56.6 92.62,70.67 v91.44,69.5 | U$54.6 78.22,79.54 v78.11,79.66 | U$67.6 83.3,42.71 v83.19,42.83 | U$66.6 71.96,42.71 v71.75,42.83 | v60.33,42.83 60.44,42.71 U$65.6 62.77,42.39 | U$64.6 50.91,46.52 v50.8,46.64 | U$69.6 49.73,34.78 v49.21,34.57 | U$70.6 59.26,30.65 v59.05,30.44 | U$71.6 72.28,30.65 v72.07,30.44 | U$72.6 84.98,30.65 v84.77,30.44 | U$68.6 95.14,46.84 v93.66,45.37 | U$73.6 96.09,34.78 v95.25,33.94 | U$34.6 76.72,142.41 v76.52,142.2 | v67.31,142.2 67.52,142.41 U$33.6 70.91,141.26 C33.2 | U$35.6 59.26,134.15 v59.05,133.95 | U$48.6 87.52,95.74 v87.31,95.53 | U$50.6 77.36,91.61 v77.15,91.4 | U$52.6 90.06,83.35 v89.22,82.51 | U$44.6 87.84,108.12 v87.63,106.33 | U$46.6 76.72,103.99 v76.52,103.79 | U$45.6 67.83,103.99 v67.63,103.79 | U$42.6 76.72,116.06 v76.52,115.85 | U$41.6 67.83,116.06 v67.63,115.85 | U$43.6 58.31,108.12 v58.1,107.91 | U$39.6 58.31,121.45 v58.1,121.25 | v44.45,112.36 44.66,112.15 U$5.6 43.7,110.23 C5.2 | v46.67,129.5 46.88,129.3 U$4.6 45.92,127.38 C4.2 | v48.26,143.16 48.47,142.95 U$3.6 47.51,141.03 C3.2 | U$1.6 65.29,158.19 v65.41,158.08 | U$40.6 87.52,121.45 v86.04,119.98
  Top 0.813: 34.29,28.63 33.85,28.63 C14.2 | 33.02,18.16 32.27,18.16 C15.2 | C36.2 87.31,132.68 87,133 | 100.97,147.51 101.72,147.51 C31.2 | U$23.6 135.78,70.34 v135.57,70.13 | U$37.6 69.75,127.82 v68.58,126.65
  Bottom 0.813: v49.85,151.73 49.53,150.14 | 116.2,54.26 116.2,53.62 | v116.2,36.16 117.16,36.16 | v114.3,53.3 116.2,53.62 | 116.2,53.62 116.2,51.72 | v118.11,22.51 119.38,22.51 119.38,21.24 | v119.38,12.03 118.75,12.35 118.75,11.71 | v104.78,6.95 104.14,6.95 104.14,6.63 | v96.2,21.87 95.89,21.87 95.89,21.24 | v85.41,18.38 85.09,18.7 | v71.75,18.06 71.75,17.43 | v58.74,18.06 59.05,17.43 | v48.26,21.87 47.62,21.87 47.62,19.97 | v34.29,30.76 34.29,31.4 | v33.02,19.97 33.02,20.6 | v39.37,6.95 39.37,7.9 | v36.2,44.41 36.2,45.37 | v38.42,61.24 38.42,62.19 | v37.47,75.85 37.47,75.21 | v150.81,80.61 151.13,80.61 | v129.22,80.93 130.17,80.93 | v139.38,80.61 140.34,80.61 140.34,81.56 | v107.95,70.77 107.95,70.13 | v109.86,87.28 111.76,87.28 111.76,86.01 | v107.95,104.42 109.86,105.06 109.86,103.79 | v105.73,121.25 107.95,121.57 107.95,118.39 | v103.82,135.22 104.14,135.54 104.14,134.27 | v100.97,145.7 102.87,145.7 102.87,144.43 | v93.34,159.98 93.34,159.67 | v87,131.09 88.27,132.36 88.27,131.09 | v78.11,126.01 81.28,126.65 81.28,126.01 | v8.26,82.51 8.26,82.2 | v19.68,82.51 20.32,82.51 20.32,82.2 | v29.84,82.51 31.75,82.51 31.75,82.83 | v40.64,93.94 40.64,93.63 | v8.57,71.08 8.89,70.77 | v53.98,71.4 52.07,71.4 50.16,73.31 | v55.25,83.47 55.25,82.83 53.98,81.56 | v66.04,79.66 64.14,77.75 | v66.67,91.72 66.04,91.09 | v56.52,95.53 56.52,94.9 | v65.41,66.96 63.5,66.96 | v52.07,58.7 52.07,57.43 | v61.59,54.89 60.96,54.89 | v71.75,54.89 71.75,54.26 | v81.92,54.89 81.92,54.26 | v78.74,66.96 78.11,66.32 | v92.08,58.7 92.08,57.43 | v91.44,69.5 90.81,68.86 | v78.11,79.66 77.47,79.02 | v83.19,42.83 83.19,42.19 | v71.75,42.83 71.12,42.83 | v60.33,42.83 59.69,42.19 | v50.8,46.64 50.8,46
  Bottom 0.813: v49.21,34.57 48.9,33.94 | v59.05,30.44 59.05,30.13 | v72.07,30.44 71.12,29.49 | v84.77,30.44 83.82,29.49 | v93.66,45.37 93.98,45.05 93.66,44.73 | v95.25,33.94 95.25,32.67 | v76.52,142.2 75.56,141.25 | v67.31,142.2 66.36,142.2 66.04,141.89 | v59.05,133.95 59.05,133.63 58.42,133 | v87.31,95.53 87.31,95.21 88.27,94.26 | v77.15,91.4 77.15,90.77 76.84,90.45 | v89.22,82.51 89.53,82.2 | v87.63,106.33 87.95,106.01 | v76.52,103.79 76.2,103.79 | v67.63,103.79 67.63,103.47 67.95,103.15 | v76.52,115.85 76.52,115.53 76.2,115.22 | v67.63,115.85 67.63,115.53 67.31,115.22 | v58.1,107.91 58.1,107.28 57.79,106.96 | v58.1,121.25 56.52,119.66 | v44.45,112.36 44.45,112.04 | v46.67,129.5 46.36,129.82 | v48.26,143.16 48.26,143.79 | v65.41,158.08 65.41,159.03 | v86.04,119.98 86.04,119.34 86.36,119.03 | v135.57,70.13 135.57,69.18 135.25,68.86 | v68.58,126.65 67.31,126.65
  pour Bottom: 37.47,-0.35 47.62,-3.53 117.48,-2.89 133.35,21.24 127.64,49.18 171.45,87.28 119.38,89.82 109.86,164.11 43.18,166.02 32.38,90.45 -20.32,88.55 19.68,53.62 24.13,14.89 37.47,0.28
N$1
  Top 0.305: U$1.3 56.09,154.79 55.25,153.95 55.25,151.3 | 55.25,150.78 55.25,151.3 | 55.25,151.3 U$2.4
N$2
  Top 0.305: U$1.2 55.88,156.49 53.34,153.95 U$2.5 53.34,150.78
N$3
  Top 0.305: U$3.3 51.87,133.11 50.16,131.41 50.16,127.49 U$4.4
N$4
  Top 0.305: U$3.2 50.16,133.95 48.58,132.04 U$4.5 48.58,126.96 48.26,126.65 48.26,127.28 48.9,127.92
N$5
  Top 0.305: U$2.3 55.04,144.86 52.07,141.89 52.07,141.46 U$3.4
N$6
  Top 0.305: U$3.5 50.48,142.2 53.34,145.06 U$2.2
N$7
  Top 0.305: U$5.3 48.05,100.72 45.72,98.39 45.72,93.52 U$6.4
N$8
  Top 0.305: U$5.2 46.36,101.25 44.13,99.02 U$6.5
N$9
  Top 0.305: U$7.3 24.99,77 19.46,77 U$8.4
N$10
  Top 0.305: U$7.2 U$8.5
N$11
  Top 0.305: U$6.3 45.83,88.02 34.92,77.12 29.51,77.12 U$7.4
N$12
  Top 0.305: U$6.2 44.13,88.23 34.92,79.02 U$7.5
N$13
  Top 0.305: U$4.2 48.58,120.61 46.36,118.39 U$5.5
N$14
  Top 0.305: U$4.3 50.28,119.77 47.94,117.44 47.94,110.34 U$5.4
N$15
  Top 0.305: U$10.4 8.46,73.74 4.88,77.32 U$9.3
N$16
  Top 0.305: U$10.5 7.62,72.04 3.81,75.85 2.54,75.85 1.91,76.48 1.91,78.39 2.54,79.02 U$9.2
N$17
  Top 0.305: U$11.3 43.93,66.12 41.59,63.78 41.59,59.54 U$12.4
N$18
  Top 0.305: U$11.2 42.23,66.64 40.01,64.42 U$12.5
N$19
  Top 0.305: U$10.3 14.7,74.04 15.88,75.21 33.97,75.21 37.15,78.39 43.18,78.39 43.82,77.75 43.82,76.37 U$11.4
N$20
  Top 0.305: U$10.2 15.88,72.04 16.51,72.67 16.51,73.94 17.14,74.58 34.29,74.58 37.47,77.75 41.91,77.75 42.23,77.43 U$11.5
N$21
  Top 0.305: U$13.3 39.48,35 37.78,33.3 37.78,28.75 U$14.4
N$22
  Top 0.305: U$13.2 37.78,35.52 36.2,33.94 U$14.5
N$23
  Top 0.305: U$15.3 36.62,12.55 38.73,10.44 41.29,10.44 U$16.4
N$24
  Top 0.305: U$16.5 38.73,8.54 34.92,12.35 U$15.2
N$25
  Top 0.305: U$14.3 37.9,21.98 36.83,20.92 36.83,18.36 U$15.4
N$26
  Top 0.305: U$14.2 36.2,22.51 34.92,21.24 U$15.5
N$27
  Top 0.305: U$12.2 40.01,50.13 37.78,47.91 U$13.5
N$28
  Top 0.305: U$12.3 41.71,49.61 39.37,47.27 39.37,42.72 U$13.4
N$29
  Top 0.305: 8.35,78.7 U$9.5 U$8.2
N$30
  Top 0.305: 8.35,77 U$9.4 U$8.3
N$31
  Top 0.305: U$17.3 114.09,10.24 116.2,12.35 116.2,13.73 U$18.4
N$32
  Top 0.305: U$17.2 114.94,8.54 117.79,11.39 U$18.5
N$33
  Top 0.305: U$20.4 112.92,32.14 114.94,30.13 114.94,28.75 U$19.3
N$34
  Top 0.305: U$20.5 114.62,32.35 116.52,30.44 U$19.2
N$35
  Top 0.305: U$19.4 114.82,21.35 116.2,19.97 116.2,17.95 U$18.3
N$36
  Top 0.305: U$19.5 116.52,22.19 117.79,20.92 U$18.2
N$37
  Top 0.305: U$21.3 111.12,59.54 111.12,63.15 105.57,68.54 105.57,74.89 107.31,76.32 108.28,76.32 U$22.4
N$38
  Top 0.305: U$21.2 112.55,63.62 106.68,69.5 106.68,73.94 107.31,74.58 U$22.5
N$39
  Top 0.305: U$23.3 143.81,75.85 148.27,75.85 148.69,76.26 U$24.4
N$40
  Top 0.305: U$24.5 149.86,79.02 150.5,78.39 150.5,76.48 148.59,74.58 146.05,74.58 143.51,72.04 U$23.2
N$41
  Top 0.305: U$22.3 113.87,75.96 114.3,75.53 136.84,75.53 137.8,74.58 137.8,73.83 U$23.4
N$42
  Top 0.305: U$22.2 135.25,74.26 135.89,73.62 135.89,72.67 136.53,72.04 U$23.5
N$43
  Top 0.305: U$21.5 112.55,47.75 114.62,45.68 U$20.2
N$44
  Top 0.305: U$21.4 110.85,47.54 113.03,45.37 113.03,42.72 U$20.3
N$45
  Top 0.305: U$26.4 U$25.3 | U$25.3 133.56,77.32 133.99,77.75 133.69,77.75 U$25.3
N$46
  Top 0.305: U$26.5 U$25.2
N$47
  Top 0.305: U$28.4 104.34,98.5 106.68,96.17 106.68,93.52 U$27.3
N$48
  Top 0.305: U$28.5 106.05,98.71 108.27,96.48 U$27.2
N$49
  Top 0.305: U$27.4 106.57,86.01 115.25,77.32 U$26.3
N$50
  Top 0.305: U$26.2 115.89,79.02 108.27,86.64 U$27.5
N$51
  Top 0.305: U$30.4 100.53,132.16 102.55,130.14 102.55,127.49 U$29.3
N$52
  Top 0.305: U$30.5 102.23,132.68 104.14,130.77 U$29.2
N$53
  Top 0.305: U$32.4 95.36,154.79 97.47,152.68 97.47,151.09 97.36,150.98 | U$31.3 97.36,150.98 | 97.36,150.98 97.16,150.78
N$54
  Top 0.305: U$32.5 95.89,156.49 99.06,153.32 U$31.2
N$55
  Top 0.305: U$31.4 97.36,146.13 100.65,142.84 100.65,141.46 U$30.3
N$56
  Top 0.305: U$31.5 99.06,145.7 102.23,142.52 U$30.2
N$57
  Top 0.305: U$29.5 104.14,117.12 106.05,115.22 U$28.2
N$58
  Top 0.305: U$29.4 102.44,116.28 104.78,113.95 104.78,110.66 U$28.3
N$59
  Top 0.305: U$25.5 U$24.2
N$60
  Top 0.305: U$25.4 U$24.3
N$61
  Top 0.305: U$17.4 104.98,10.24 104.46,10.76 104.46,14.25 103.47,15.4 103.03,15.84 91.76,15.84 89.53,13.62 62.55,13.62 60.01,16.16 50.16,16.16 48.9,14.89 48.9,11.71 47.42,10.24 U$16.3
N$62
  Top 0.305: U$17.5 104.46,8.54 103.19,9.81 103.19,13.93 101.92,15.2 92.39,15.2 90.17,12.98 62.23,12.98 59.69,15.52 50.8,15.52 49.53,14.25 49.53,9.81 48.26,8.54 U$16.2
N$63
  Top 0.305: U$34.4 U$33.3
N$64
  Top 0.305: U$33.2 U$34.5 | U$34.5 79.06,144.11 79.38,143.79 78.96,143.79 U$34.5
N$65
  Top 0.305: U$36.4 U$35.3
N$66
  Top 0.305: U$35.2 U$36.5
N$67
  Top 0.305: U$34.3 84.34,145.81 85.73,144.43 85.73,139.98 84.45,138.71 61.59,138.71 61.28,138.39 61.28,137.65 U$35.4
N$68
  Top 0.305: U$34.2 84.14,144.11 84.45,143.79 84.45,139.98 83.82,139.35 60.33,139.35 59.69,138.71 59.69,136.17 60.01,135.85 U$35.5
N$69
  Top 0.305: U$37.3 U$38.4 | U$38.4 79.26,131.84 79.38,131.73 78.76,131.73 U$38.4
N$70
  Top 0.305: U$37.2 U$38.5
N$71
  Top 0.305: U$40.4 U$39.3
N$72
  Top 0.305: U$39.2 U$40.5
N$73  (via drill 0.6)
  Top 0.305: U$38.3 82.64,131.82 82.55,131.73 84.45,131.73 v87.95,128.23 | v60.33,126.96 60.33,124.95 U$39.4
  Bottom 0.305: v87.95,128.23 61.59,128.23 v60.33,126.96
N$74  (via drill 0.6)
  Top 0.305: U$38.2 84.14,130.14 v85.09,129.19 | v57.79,122.84 59.91,122.84 U$39.5
  Bottom 0.305: v85.09,129.19 59.69,129.19 57.79,127.28 v57.79,122.84
N$75  (via drill 0.6)
  Top 0.305: U$36.2 v92.71,135.85 | v67.31,130.14 U$37.5
  Bottom 0.305: v92.71,135.85 67.95,135.85 67.31,135.22 v67.31,130.14
N$76  (via drill 0.6)
  Top 0.305: v69.85,134.9 69.85,131.93 U$37.4 | U$36.3 93.71,137.71 94.3,137.12 v94.3,134.9
  Bottom 0.305: v94.3,134.9 v69.85,134.9
N$77
  Top 0.305: U$41.3 U$42.4
N$78
  Top 0.305: U$41.2 U$42.5 79.38,117.76
N$79
  Top 0.305: U$44.4 U$43.3
N$80
  Top 0.305: U$43.2 U$44.5
N$81
  Top 0.305: U$43.4 60.55,112.26 60.96,112.68 83.82,112.68 85.73,114.58 85.73,118.39 84.45,119.66 82.85,119.66 U$42.3
N$82
  Top 0.305: U$43.5 59.37,109.82 59.05,110.14 59.05,112.68 59.69,113.31 82.55,113.31 84.45,115.22 84.45,117.12 83.82,117.76 U$42.2
N$83
  Top 0.305: U$45.3 U$46.4
N$84
  Top 0.305: U$45.2 U$46.5 79.38,105.69
N$85
  Top 0.305: U$47.3 62.96,99.25 62.87,99.34 89.96,99.34 | 90.17,99.34 89.96,99.34 | 89.96,99.34 U$48.4
N$86
  Top 0.305: U$47.2 U$48.5
N$87
  Top 0.305: U$47.4 58.96,99.88 59.69,100.61 83.82,100.61 85.73,102.52 85.73,106.33 84.66,107.39 U$46.3
N$88
  Top 0.305: U$47.5 57.79,97.44 57.15,98.07 57.15,100.61 57.79,101.25 83.19,101.25 84.45,102.52 84.45,105.06 83.82,105.69 U$46.2
N$89  (via drill 0.6)
  Top 0.305: U$44.2 93.03,110.14 v93.98,110.14 | v67.31,105.69 U$45.5
  Bottom 0.305: v93.98,110.14 68.58,110.14 67.31,108.87 v67.31,105.69
N$90  (via drill 0.6)
  Top 0.305: U$45.4 69.75,108.77 v69.85,108.87 | U$44.3 95.14,111.52 95.89,110.77 v95.89,108.87
  Bottom 0.305: v69.85,108.87 v95.89,108.87
N$91  (via drill 0.6)
  Top 0.305: U$41.5 v67.31,117.76 | 92.49,122.84 U$40.2 v93.98,123.15
  Bottom 0.305: v67.31,117.76 67.31,121.88 68.58,123.15 v93.98,123.15
N$92  (via drill 0.6)
  Top 0.305: U$40.3 94.82,124.85 95.57,124.11 v95.57,122.2 | v69.85,121.09 69.85,119.55 U$41.4
  Bottom 0.305: v95.57,122.2 70.96,122.2 v69.85,121.09
N$93
  Top 0.305: U$33.4 69.75,147.51 70.48,148.24 86.36,148.24 88.58,150.46 88.58,154.7 U$32.3
N$94
  Top 0.305: U$33.5 68.26,144.11 67.95,144.43 67.95,148.24 69.22,149.51 85.73,149.51 87,150.78 87,155.86 87.63,156.49 U$32.2
N$95
  Top 0.305: U$49.3 U$50.4
N$96
  Top 0.305: U$49.2 U$50.5
N$97
  Top 0.305: U$51.3 U$52.4
N$98
  Top 0.305: U$52.5 91.76,85.05 92.08,85.37 U$52.5 | U$51.2 62.55,85.05 63.5,86.01 88.27,86.01 88.74,85.37 U$52.5
N$99
  Top 0.305: U$51.4 57.37,87.5 57.79,87.91 84.45,87.91 87,90.45 87,94.26 86.36,94.9 84.12,94.9 U$50.3
N$100
  Top 0.305: U$51.5 55.56,85.05 55.25,85.37 55.25,87.91 55.88,88.55 83.82,88.55 85.73,90.45 85.73,92.99 85.41,93.31 U$50.2
N$101
  Top 0.305: U$53.3 U$54.4
N$102
  Top 0.305: 80.64,80.93 80.33,81.24 U$54.5 U$53.2
N$103
  Top 0.305: U$55.3 U$56.4
N$104
  Top 0.305: U$55.2 U$56.5
N$105
  Top 0.305: U$55.4 55.79,75.12 56.52,75.85 85.73,75.85 87.63,77.75 87.63,81.56 86.36,82.83 84.34,82.83 U$54.3
N$106
  Top 0.305: U$55.5 54.93,72.99 53.98,73.94 53.98,75.85 54.61,76.48 84.45,76.48 86.36,78.39 86.36,80.93 86.04,81.24 U$54.2
N$107  (via drill 0.6)
  Top 0.305: U$52.2 v96.84,85.37 | U$53.5 v66.36,81.24
  Bottom 0.305: v96.84,85.37 67.31,85.37 66.36,84.42 v66.36,81.24
N$108  (via drill 0.6)
  Top 0.305: U$53.4 68.17,84.32 v68.26,84.42 | v99.06,84.42 99.06,85.69 98.11,86.64 95.46,86.64 U$52.3
  Bottom 0.305: v68.26,84.42 v99.06,84.42
N$109
  Top 0.305: U$57.3 U$58.4 81.48,70.56
N$110
  Top 0.305: U$57.2 U$58.5
N$111
  Top 0.305: U$60.4 64.04,60.7 62.23,62.51 58.72,62.51 U$59.3
N$112
  Top 0.305: U$60.5 62.87,56.8 61.59,58.07 61.59,59.97 60.96,60.61 U$59.2
N$113
  Top 0.305: U$58.3 86.56,70.56 88.27,68.86 88.27,66.32 85.73,63.78 54.93,63.78 54.2,63.05 U$59.4
N$114
  Top 0.305: U$58.2 86.36,68.86 87,68.23 87,66.32 85.09,64.42 53.34,64.42 52.71,63.78 52.71,61.24 53.34,60.61 U$59.5
N$115
  Top 0.305: U$61.3 U$62.4
N$116
  Top 0.305: U$61.2 U$62.5
N$117
  Top 0.305: U$63.3 99.58,62.62 102.23,59.97 102.23,54.26 99.38,51.4 53.66,51.4 52.93,50.67 U$64.4
N$118
  Top 0.305: U$63.2 99.38,60.92 100.33,59.97 100.33,54.26 98.11,52.03 52.39,52.03 51.44,51.08 51.44,48.54 51.75,48.22 U$64.5
N$119
  Top 0.305: U$62.3 88.36,59.43 91.44,62.51 94.31,62.51 | 94.62,62.51 94.31,62.51 | 94.31,62.51 U$63.4
N$120
  Top 0.305: U$62.2 90.17,56.8 90.81,57.43 90.81,59.34 92.08,60.61 93.89,60.61 U$63.5
N$121
  Top 0.305: U$60.2 U$61.5
N$122
  Top 0.305: U$60.3 U$61.4
N$123  (via drill 0.6)
  Top 0.305: U$56.2 v98.42,72.99 | U$57.5 v65.72,68.86
  Bottom 0.305: v98.42,72.99 69.85,72.99 69.22,72.99 66.99,72.99 65.72,71.72 v65.72,68.86
N$124  (via drill 0.6)
  Top 0.305: U$56.3 96.73,74.58 99.06,74.58 100.33,73.31 v100.33,72.04 | U$57.4 67.53,71.94 v67.63,72.04
  Bottom 0.305: v67.63,72.04 99.7,72.04 v100.33,72.04
N$125  (via drill 0.6)
  Top 0.305: U$49.4 68.8,96.39 v68.9,96.48 | U$48.3 96.73,99.14 97.47,98.39 v97.47,96.48
  Bottom 0.305: v68.9,96.48 v97.47,96.48
N$126  (via drill 0.6)
  Top 0.305: 94.62,97.44 U$48.2 v95.57,97.44 | U$49.5 v66.99,93.31
  Bottom 0.305: v66.99,93.31 66.99,96.48 67.95,97.44 v95.57,97.44
N$127
  Top 0.305: U$65.3 U$66.4
N$128
  Top 0.305: U$65.2 U$66.5
N$129
  Top 0.305: U$68.4 94.41,50.24 90.17,46 89.74,46 U$67.3
N$130
  Top 0.305: U$67.2 91.12,44.41 93.03,46.32 93.03,47.27 94.3,48.54 U$68.5
N$131
  Top 0.305: U$67.4 U$66.3
N$132
  Top 0.305: U$67.5 U$66.2
N$133
  Top 0.305: U$70.4 61.59,34.14 60.12,34.14 59.69,34.57 59.69,37.11 58.74,38.06 55.45,38.06 U$69.3
N$134
  Top 0.305: U$70.5 59.37,32.35 58.42,33.3 58.42,35.84 57.79,36.48 U$69.2
N$135
  Top 0.305: U$71.3 U$72.4
N$136
  Top 0.305: U$71.2 U$72.5
N$137
  Top 0.305: U$70.3 74.82,33.73 74.93,33.94 74.41,33.94 U$71.4
N$138
  Top 0.305: U$70.2 73.88,32.03 U$71.5
N$139
  Top 0.305: U$69.5 50.8,36.48 49.53,37.11 49.53,39.33 50.48,40.29 59.69,40.29 62.23,37.75 91.44,37.75 93.98,40.29 96.52,40.29 102.23,46 102.23,47.59 101.6,48.22 U$68.2
N$140
  Top 0.305: U$69.4 51.02,38.92 52.07,39.65 59.05,39.65 61.59,37.11 92.08,37.11 94.62,39.65 97.16,39.65 102.87,45.37 102.87,48.86 101.81,49.92 U$68.3
N$141
  Top 0.305: U$73.3 103.08,38.18 104.78,36.48 104.78,32.03 99.7,26.95 93.98,26.95 91.44,24.41 59.69,24.41 57.15,26.95 50.48,26.95 50.07,26.54 U$74.4
N$142
  Top 0.305: U$73.2 102.87,36.48 103.5,35.84 103.5,32.03 99.06,27.59 93.34,27.59 90.81,25.05 60.33,25.05 57.79,27.59 48.9,27.59 48.26,26.95 48.26,24.41 48.9,23.78 U$74.5
N$143
  Top 0.305: U$75.3 U$76.4
N$144
  Top 0.305: U$75.2 U$76.5
N$145
  Top 0.305: U$74.3 57.05,25.48 U$75.4
N$146
  Top 0.305: U$74.2 55.25,23.78 59.05,19.97 U$75.5
N$147
  Top 0.305: U$77.3 91.85,22.92 94.62,25.68 98.12,25.68 U$78.4
N$148
  Top 0.305: U$77.2 93.66,20.28 94.62,21.24 94.62,23.14 95.25,23.78 U$78.5
N$149  (via drill 0.6)
  Top 0.305: v63.18,151.73 63.18,154.7 U$1.4
  Bottom 0.305: DI.1 66.67,145.7 63.18,149.19 v63.18,151.73
N$150  (via drill 0.6)
  Top 0.305: v65.41,151.41 65.41,155.86 64.77,156.49 U$1.5
  Bottom 0.305: CI.1 73.66,147.6 71.12,150.14 66.67,150.14 v65.41,151.41
N$151  (via drill 0.6)
  Top 0.305: v104.14,25.68 102.53,25.68 U$78.3
  Bottom 0.305: DO.1 112.39,25.68 111.12,26.95 105.41,26.95 v104.14,25.68
N$152  (via drill 0.6)
  Top 0.305: U$78.2 v104.14,23.78
  Bottom 0.305: v104.14,23.78 106.05,23.78 CO.1
N$153
  Top 0.305: U$76.2 U$77.5
N$154
  Top 0.305: U$76.3 U$77.4
N$155
  Top 0.305: U$73.5 95.89,36.48 93.98,34.57 93.98,32.67 93.34,32.03 91.53,32.03 U$72.2
N$156
  Top 0.305: U$73.4 95.34,38.18 U$72.3
N$157
  Top 0.305: U$64.3 58.96,49.92 U$65.4
N$158
  Top 0.305: U$64.2 58.1,48.22 59.69,46.64 59.69,45.05 60.33,44.41 U$65.5

### Text on the board
bNames: SOC Level Indicator Rev. 1